# EAGLE schematic van-tracker-Bostig (EAGLE 9.5.1)
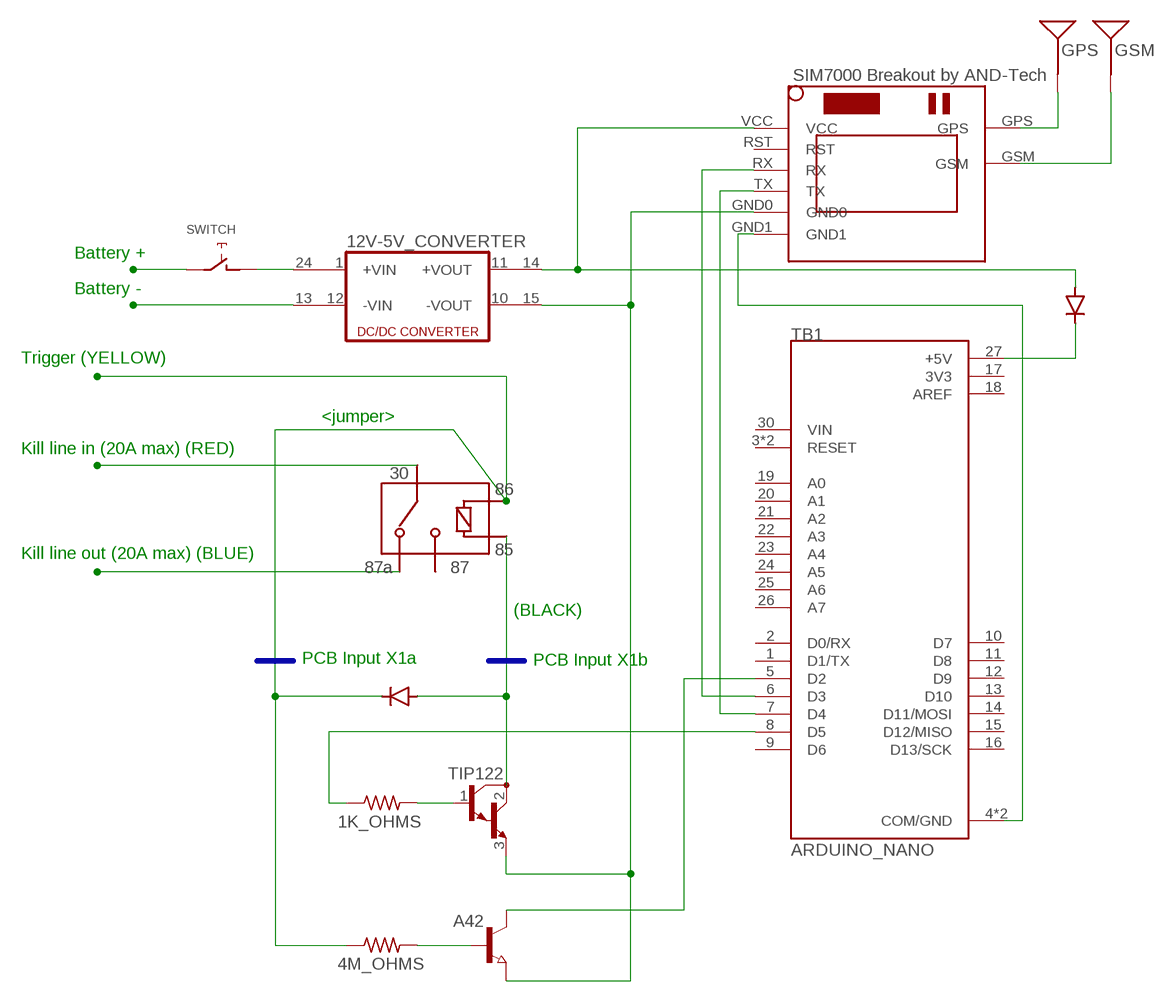
[diagram p0: schematic, sheet 1]

## Parts
1K_OHMS  R-US_0411/15  [0411/15]
4M_OHMS  R-US_0411/15  [0411/15]
12V-5V_CONVERTER  DC213R  [CMK]
A42  NPN-TRANSISTOR_SOT23  [SOT23]
D1  1N5400  [DO201-15]
D2  1N5400  [DO201-15]
GPS  1.575GHz  ANTENNAGPS-2X7MM  [ANT-GPS-2X7MM]
GSM  1.575GHz  ANTENNAGPS-2X7MM  [ANT-GPS-2X7MM]
Q1  TIP122  [TO220]
SWITCH  EC12E_SW  [ALPS_EC12E_SW]
TB1  ARDUINO_NANO  [SHIELD_ARDUINO_NANO]
U$1  SIM800LMODULE  [SIM800LMODULE]

## Nets
N$1: SWITCH.E
N$2: 12V-5V_CONVERTER.13(-VIN1)
N$3: GSM.1(SIGNAL) U$1.GSM
N$4: GPS.1(SIGNAL) U$1.GPS
N$5: 4M_OHMS.1 D1.C
N$6: 1K_OHMS.1 TB1.8(D5)
N$9: 12V-5V_CONVERTER.14(+VOUT1) D2.A U$1.VCC
N$10: D2.C TB1.27(+5V)
N$11: TB1.6(D3) U$1.RX
N$12: TB1.7(D4) U$1.TX
N$13: 12V-5V_CONVERTER.24(+VIN1) SWITCH.D
N$14: 4M_OHMS.2 A42.1(B)
N$15: A42.3(C) TB1.5(D2)
N$16: 1K_OHMS.2 Q1.1(B)
N$17: D1.A Q1.2(C)
N$22: TB1.4(COM/GND) TB1.29(COM/GND) U$1.GND1
N$23: 12V-5V_CONVERTER.15(-VOUT1) A42.2(E) Q1.3(E) U$1.GND0
Unconnected: 12V-5V_CONVERTER.1(+VIN) 12V-5V_CONVERTER.10(-VOUT) 12V-5V_CONVERTER.11(+VOUT) 12V-5V_CONVERTER.12(-VIN) SWITCH.A SWITCH.B SWITCH.C SWITCH.GND1(G) SWITCH.GND2(G) TB1.1(D1/TX) TB1.2(D0/RX) TB1.3(RESET) TB1.9(D6) TB1.10(D7) TB1.11(D8) TB1.12(D9) TB1.13(D10) TB1.14(D11/MOSI) TB1.15(D12/MISO) TB1.16(D13/SCK) TB1.19(A0) TB1.20(A1) TB1.21(A2) TB1.22(A3) TB1.23(A4) TB1.24(A5) TB1.25(A6) TB1.26(A7) TB1.28(RESET) TB1.30(VIN) U$1.RST

## Buses
B$1
B$2

## Notes on the sheet
- Battery +
- Battery -
- Trigger (YELLOW)
- <jumper>
- Kill line in (20A max) (RED)
- Kill line out (20A max) (BLUE)
- (BLACK)
- PCB Input X1a | PCB Input X1b

## Power pins joined to a net without a drawn wire
3V3: TB1.17(3V3)
AREF: TB1.18(AREF)

## Library data of the parts
1K_OHMS 4M_OHMS = rcl:R-US_: RESISTOR, American symbol; SPICEPREFIX: R
12V-5V_CONVERTER = dc-dc-converter:DC213R: DC-DC CONVERTER; OC_FARNELL: unknown; OC_NEWARK: unknown
A42 = semicon-smd-ipc:NPN-TRANSISTOR_: NPN TRANSISTOR
D1 D2 = diode:1N5400: DIODE standard rectifier, 3 A, 50 V (Motorola)
GPS GSM = SparkFun-GPS:ANTENNA: Single-ended Antennae 1.575GHz antennae with just one terminal. These are all chip antennae. 1575MHz (GPS) Antennae ANT-GPS-2X7MM - 2.0 x 7.0 mm chip antenna. (SparkFun Product <https://www.sparkfun.com/products/9131>) ANT-GPS-2X8MM - 2.0 x 8.0 mm chip antenna. (SparkFun Product <https://www.sparkfun.com/products/8418>); PROD_ID: ANT-09087; SF_ID: GPS-09131
Q1 = transistor-npn:TIP122*: NPN Darlington Transistor
SWITCH = switch-alps:EC12E_SW: ALPS rotary Encoder EC12E series with switch; MPN: EC12E2424407; OC_FARNELL: 1520813; OC_NEWARK: 74M1068
TB1 = ARDUINO_NANO:ARDUINO_NANO: Arduino Nano, Through Hole; AVAILABILITY: Unavailable; DESCRIPTION: Dev.kit: Arduino; UART; ICSP, USB B mini, pin strips; MF: Arduino; MP: ARDUINO NANO; PACKAGE: None; PRICE: None
U$1 = JW_SIM800LMODULE:SIM800LMODULE: SIM800L Module